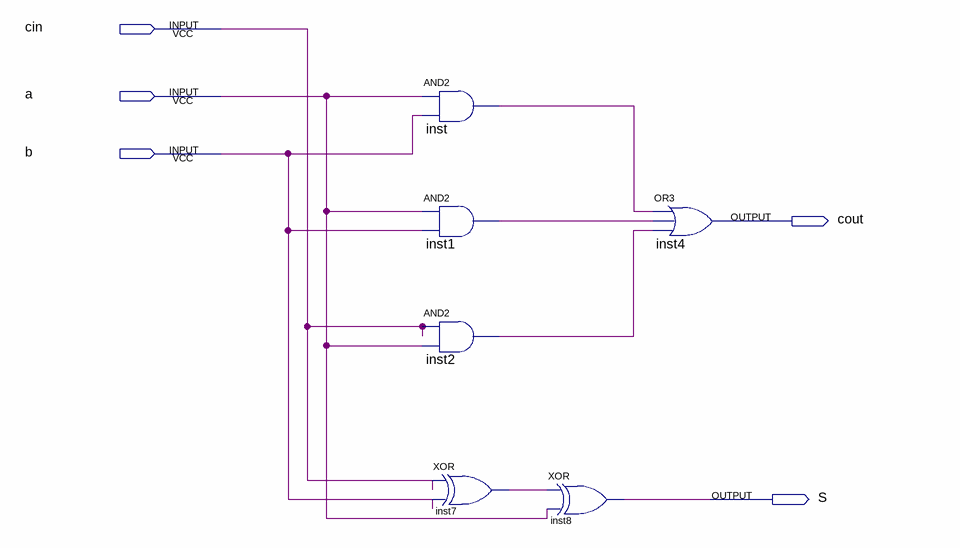
[diagram p0: schematic sheet]
// Quartus schematic AddSubDemo.bdf as structural Verilog: 6 symbols, 5 pins
module AddSubDemo (
  input  cin,
  input  a,
  input  b,
  output cout,
  output S
);

  wire inst1_out, inst2_out, inst7_out, inst_out;

  and inst (inst_out, a, b);
  and inst1 (inst1_out, a, b);
  and inst2 (inst2_out, cin, a);
  xor inst7 (inst7_out, cin, b);
  xor inst8 (S, inst7_out, a);
  or inst4 (cout, inst_out, inst1_out, inst2_out);
endmodule
